# Altium schematic sheet C210_0001_Serial_Interface_220601.SchDoc: C210_0001_Serial_Interface
size B; Date: 2/26/2021; CompanyName: U-blox; DrawnBy: EMOO; Engineer: EMOO; Organization: U-blox; Address1: 2601 25th St. SE; Address2: Salem, OR 97302; SheetNumber: 1; SheetTotal: 7; Website: www.u-blox.com; SheetSize: B; SheetTitle: C-210 Serial Interface
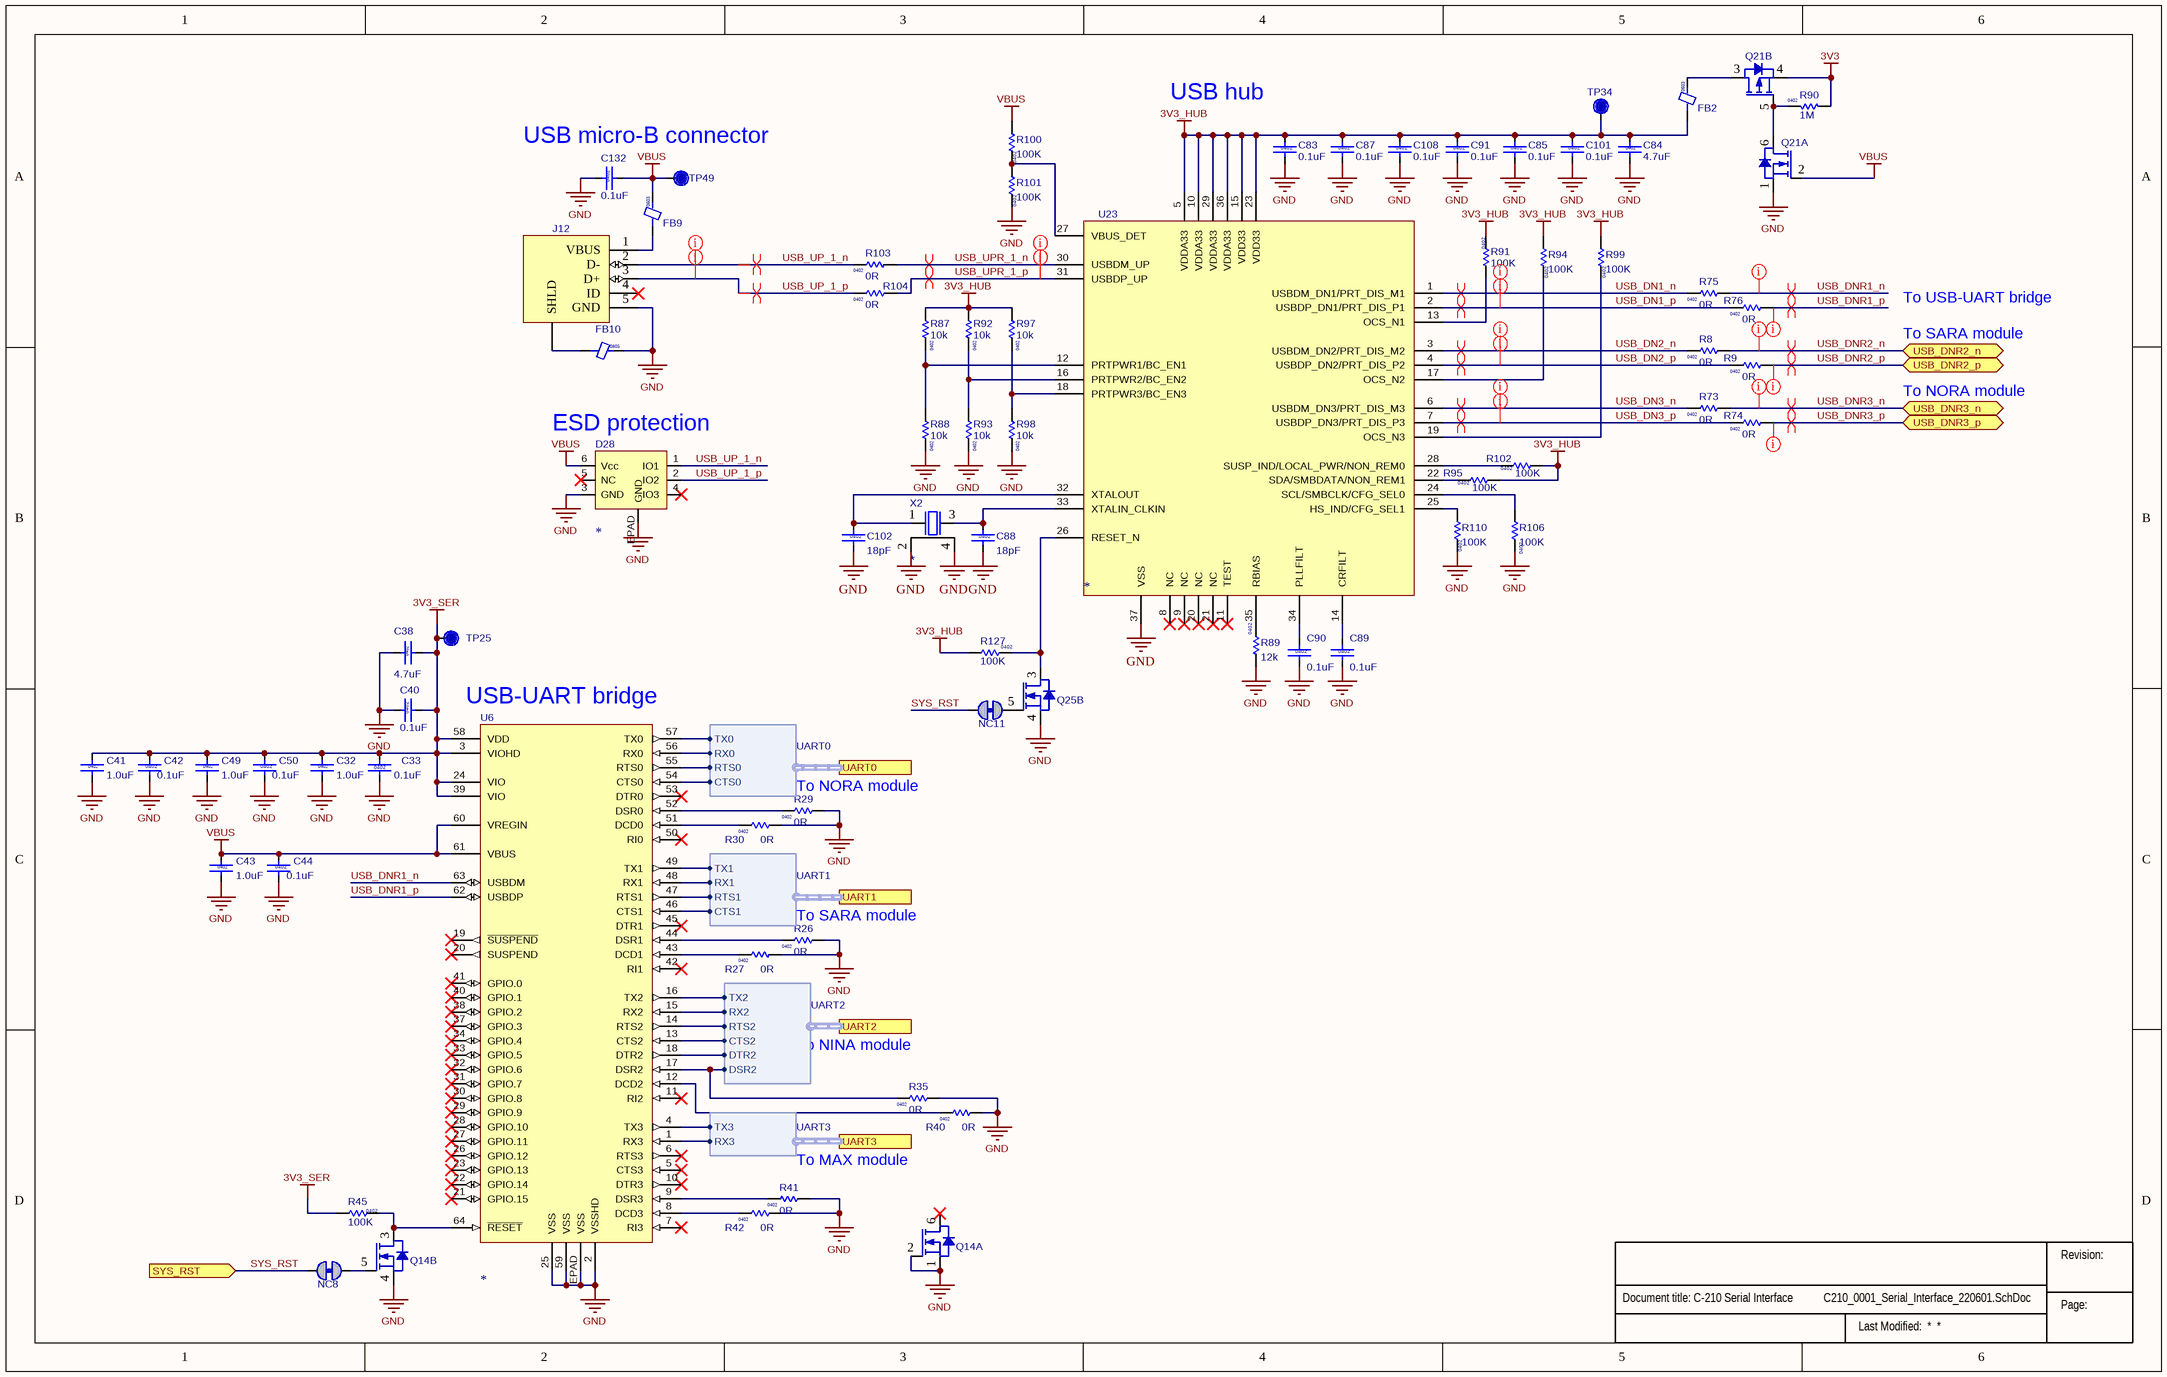
[diagram p0: C210_0001_Serial_Interface_220601.SchDoc]

## Parts
?  (no value)  (graphical)
C32  value 1.0uF  Size: 0402  [Cap 0402 HD]  (hidden comment: 120-000171.0uF)
C33  value 0.1uF  Size: 0402  [Cap 0402 HD]  (hidden comment: 120-000160.1uF)
C38  value 4.7uF  Size: 0402  [Cap 0402 HD]
C40  value 0.1uF  Size: 0402  [Cap 0402 HD]  (hidden comment: 120-000160.1uF)
C41  value 1.0uF  Size: 0402  [Cap 0402 HD]  (hidden comment: 120-000171.0uF)
C42  value 0.1uF  Size: 0402  [Cap 0402 HD]  (hidden comment: 120-000160.1uF)
C43  value 1.0uF  Size: 0402  [Cap 0402 HD]  (hidden comment: 120-000171.0uF)
C44  value 0.1uF  Size: 0402  [Cap 0402 HD]  (hidden comment: 120-000160.1uF)
C49  value 1.0uF  Size: 0402  [Cap 0402 HD]  (hidden comment: 120-000171.0uF)
C50  value 0.1uF  Size: 0402  [Cap 0402 HD]  (hidden comment: 120-000160.1uF)
C83  value 0.1uF  Size: 0402  [Cap 0402 HD]  (hidden comment: 120-000160.1uF)
C84  value 4.7uF  Size: 0402  [Cap 0402 HD]
C85  value 0.1uF  Size: 0402  [Cap 0402 HD]  (hidden comment: 120-000160.1uF)
C87  value 0.1uF  Size: 0402  [Cap 0402 HD]  (hidden comment: 120-000160.1uF)
C88  value 18pF  Size: 0402  [Cap 0402 HD]
C89  value 0.1uF  Size: 0402  [Cap 0402 HD]  (hidden comment: 120-000160.1uF)
C90  value 0.1uF  Size: 0402  [Cap 0402 HD]  (hidden comment: 120-000160.1uF)
C91  value 0.1uF  Size: 0402  [Cap 0402 HD]  (hidden comment: 120-000160.1uF)
C101  value 0.1uF  Size: 0402  [Cap 0402 HD]  (hidden comment: 120-000160.1uF)
C102  value 18pF  Size: 0402  [Cap 0402 HD]
C108  value 0.1uF  Size: 0402  [Cap 0402 HD]  (hidden comment: 120-000160.1uF)
C132  value 0.1uF  Size: 0402  [Cap 0402 HD]  (hidden comment: 120-000160.1uF)
D28  (no value)  [TPD3E001DRSR]
FB2  Size: 0603  [BLM18EG221SN1]
FB9  Size: 0603  [BLM18EG221SN1]
FB10  Size: 0805  [IND 0805]
J12  (no value)  [USB_Micro_RA_W-2TABS]
NC8  Solderbridge-ShortDNP  [Solderbridge-Short]  (value not drawn)  (net tie, no BOM)
NC11  Solderbridge-ShortDNP  [Solderbridge-Short]  (value not drawn)  (net tie, no BOM)
Q14  (no value)  [SOT-563]  (parts A,B of 2)
Q21  (no value)  [SOT-563]  (parts A,B of 2)
Q25  (no value)  [SOT-563]  (part B of 2)
R8  value 0R  Size: 0402  [RES 0402 HD]
R9  value 0R  Size: 0402  [RES 0402 HD]
R26  value 0R  Size: 0402  [RES 0402 HD]
R27  value 0R  Size: 0402  [RES 0402 HD]
R29  value 0R  Size: 0402  [RES 0402 HD]
R30  value 0R  Size: 0402  [RES 0402 HD]
R35  value 0R  Size: 0402  [RES 0402 HD]
R40  value 0R  Size: 0402  [RES 0402 HD]
R41  value 0R  Size: 0402  [RES 0402 HD]
R42  value 0R  Size: 0402  [RES 0402 HD]
R45  value 100K  Size: 0402  [RES 0402 HD]
R73  value 0R  Size: 0402  [RES 0402 HD]
R74  value 0R  Size: 0402  [RES 0402 HD]
R75  value 0R  Size: 0402  [RES 0402 HD]
R76  value 0R  Size: 0402  [RES 0402 HD]
R87  value 10k  Size: 0402  [RES 0402 HD]
R88  value 10k  Size: 0402  [RES 0402 HD]
R89  value 12k  Size: 0402  [RES 0402 HD]
R90  value 1M  Size: 0402  [RES 0402 HD]
R91  value 100K  Size: 0402  [RES 0402 HD]
R92  value 10k  Size: 0402  [RES 0402 HD]
R93  value 10k  Size: 0402  [RES 0402 HD]
R94  value 100K  Size: 0402  [RES 0402 HD]
R95  value 100K  Size: 0402  [RES 0402 HD]
R97  value 10k  Size: 0402  [RES 0402 HD]
R98  value 10k  Size: 0402  [RES 0402 HD]
R99  value 100K  Size: 0402  [RES 0402 HD]
R100  value 100K  Size: 0402  [RES 0402 HD]
R101  value 100K  Size: 0402  [RES 0402 HD]
R102  value 100K  Size: 0402  [RES 0402 HD]
R103  value 0R  Size: 0402  [RES 0402 HD]
R104  value 0R  Size: 0402  [RES 0402 HD]
R106  value 100K  Size: 0402  [RES 0402 HD]
R110  value 100K  Size: 0402  [RES 0402 HD]
R127  value 100K  Size: 0402  [RES 0402 HD]
TP25  TP  [TP12R]  (value not drawn)  (no BOM)
TP34  TP  [TP12R]  (value not drawn)  (no BOM)
TP49  TP  [TP12R]  (value not drawn)  (no BOM)
U6  (no value)  [QFN0.5P16x16-64Pin_W-Pad4.25mm]
U23  -"Part Number" + DNP  [QFN0.5P9x9-36Pin_W-PAD]  (value not drawn)
X2  (no value)  [XTAL_2520_HD]

## Ports
SYS_RST (in), UART0 (harness UART0), UART1 (harness UART1), UART2 (harness UART2), UART3 (harness UART3), USB_DNR2_n (bidir), USB_DNR2_p (bidir), USB_DNR3_n (bidir), USB_DNR3_p (bidir)

## Harnesses
UART0: TX0, RX0, RTS0, CTS0
UART1: TX1, RX1, RTS1, CTS1
UART2: TX2, RX2, RTS2, CTS2, DTR2, DSR2
UART3: TX3, RX3

## Nets
3V3: Q21.4(S2) R90.1
3V3_HUB: C83.1 C84.1 C85.1 C87.1 C91.1 C101.1 C108.1 FB2.1 R87.1 R91.2 R92.1 R94.1 R95.1 R97.1 R99.1 R102.1 R127.1 TP34.1 U23.5(VDDA33) U23.10(VDDA33) U23.15(VDD33) U23.23(VDD33) U23.29(VDDA33) U23.36(VDDA33)
3V3_SER: C32.1 C33.1 C38.2 C40.2 C41.1 C42.1 C49.1 C50.1 R45.1 TP25.1 U6.3(VIOHD) U6.24(VIO) U6.39(VIO) U6.58(VDD)
GND: C32.2 C33.2 C38.1 C40.1 C41.2 C42.2 C43.2 C44.2 C49.2 C50.2 C83.2 C84.2 C85.2 C87.2 C88.2 C89.2 C90.2 C91.2 C101.2 C102.2 C108.2 C132.1 D28.3(GND) D28.EPAD(GND) FB10.2 J12.5(GND) Q14.1(S1) Q14.2(G1) Q14.4(S2) Q21.1(S1) Q25.4(S2) R26.1 R27.1 R29.1 R30.1 R35.1 R40.1 R41.1 R42.1 R88.2 R89.1 R93.2 R98.2 R101.2 R106.2 R110.2 U6.2(VSSHD) U6.25(VSS) U6.59(VSS) U6.EPAD(VSS) U23.37(VSS) X2.2 X2.4
VBUS: C43.1 C44.1 C132.2 D28.6(Vcc) FB9.2 Q21.2(G1) R100.1 TP49.1 U6.60(VREGIN) U6.61(VBUS)
SYS_RST: NC8.2 NC11.2 ; port SYS_RST
USB_DN1_n: R75.2 U23.1(USBDM_DN1/PRT_DIS_M1)
USB_DN1_p: R76.2 U23.2(USBDP_DN1/PRT_DIS_P1)
USB_DN2_n: R8.2 U23.3(USBDM_DN2/PRT_DIS_M2)
USB_DN2_p: R9.2 U23.4(USBDP_DN2/PRT_DIS_P2)
USB_DN3_n: R73.2 U23.6(USBDM_DN3/PRT_DIS_M3)
USB_DN3_p: R74.2 U23.7(USBDP_DN3/PRT_DIS_P3)
USB_DNR1_n: R75.1 U6.63(USBDM)
USB_DNR1_p: R76.1 U6.62(USBDP)
USB_DNR2_n: R8.1 ; port USB_DNR2_n
USB_DNR2_p: R9.1 ; port USB_DNR2_p
USB_DNR3_n: R73.1 ; port USB_DNR3_n
USB_DNR3_p: R74.1 ; port USB_DNR3_p
USB_UP_1_n: D28.1(IO1) J12.2(D-) R103.2
USB_UP_1_p: D28.2(IO2) J12.3(D+) R104.2
USB_UPR_1_n: R103.1 U23.30(USBDM_UP)
USB_UPR_1_p: R104.1 U23.31(USBDP_UP)
NetC88_1: C88.1 U23.33(XTALIN_CLKIN) X2.3
NetC89_1: C89.1 U23.14(CRFILT)
NetC90_1: C90.1 U23.34(PLLFILT)
NetC102_1: C102.1 U23.32(XTALOUT) X2.1
NetFB2_2: FB2.2 Q21.3(D2)
NetFB9_1: FB9.1 J12.1(VBUS)
NetFB10_1: FB10.1 J12.6(SHLD)
NetNC8_1: NC8.1 Q14.5(G2)
NetNC11_1: NC11.1 Q25.5(G2)
NetQ14_3: Q14.3(D2) R45.2 U6.64(~{RESET})
NetQ21_5: Q21.5(G2) Q21.6(D1) R90.2
NetQ25_3: Q25.3(D2) R127.2 U23.26(RESET_N)
NetR26_2: R26.2 U6.44(DSR1)
NetR27_2: R27.2 U6.43(DCD1)
NetR29_2: R29.2 U6.52(DSR0)
NetR30_2: R30.2 U6.51(DCD0)
NetR35_2: R35.2 U6.17(DSR2) ; port UART2.DSR2
NetR40_2: R40.2 U6.12(DCD2)
NetR41_2: R41.2 U6.9(DSR3)
NetR42_2: R42.2 U6.8(DCD3)
NetR87_2: R87.2 R88.1 U23.12(PRTPWR1/BC_EN1)
NetR89_2: R89.2 U23.35(RBIAS)
NetR91_1: R91.1 U23.13(OCS_N1)
NetR92_2: R92.2 R93.1 U23.16(PRTPWR2/BC_EN2)
NetR94_2: R94.2 U23.17(OCS_N2)
NetR95_2: R95.2 U23.22(SDA/SMBDATA/NON_REM1)
NetR97_2: R97.2 R98.1 U23.18(PRTPWR3/BC_EN3)
NetR99_2: R99.2 U23.19(OCS_N3)
NetR100_2: R100.2 R101.1 U23.27(VBUS_DET)
NetR102_2: R102.2 U23.28(SUSP_IND/LOCAL_PWR/NON_REM0)
NetR106_1: R106.1 U23.24(SCL/SMBCLK/CFG_SEL0)
NetR110_1: R110.1 U23.25(HS_IND/CFG_SEL1)
NetU6_1: U6.1(RX3) ; port UART3.RX3
NetU6_4: U6.4(TX3) ; port UART3.TX3
NetU6_13: U6.13(CTS2) ; port UART2.CTS2
NetU6_14: U6.14(RTS2) ; port UART2.RTS2
NetU6_15: U6.15(RX2) ; port UART2.RX2
NetU6_16: U6.16(TX2) ; port UART2.TX2
NetU6_18: U6.18(DTR2) ; port UART2.DTR2
NetU6_46: U6.46(CTS1) ; port UART1.CTS1
NetU6_47: U6.47(RTS1) ; port UART1.RTS1
NetU6_48: U6.48(RX1) ; port UART1.RX1
NetU6_49: U6.49(TX1) ; port UART1.TX1
NetU6_54: U6.54(CTS0) ; port UART0.CTS0
NetU6_55: U6.55(RTS0) ; port UART0.RTS0
NetU6_56: U6.56(RX0) ; port UART0.RX0
NetU6_57: U6.57(TX0) ; port UART0.TX0

Not connected (* = marked no-connect by the designer): D28 4(IO3)* 5(NC)*; J12 4(ID)*; Q14 6(D1)*; U6 5(CTS3)* 6(RTS3)* 7(RI3)* 10(DTR3)* 11(RI2)* 19(~{SUSPEND})* 20(SUSPEND)* 21(GPIO.15)* 22(GPIO.14)* 23(GPIO.13)* 26(GPIO.12)* 27(GPIO.11)* 28(GPIO.10)* 29(GPIO.9)* 30(GPIO.8)* 31(GPIO.7)* 32(GPIO.6)* 33(GPIO.5)* 34(GPIO.4)* 37(GPIO.3)* 38(GPIO.2)* 40(GPIO.1)* 41(GPIO.0)* 42(RI1)* 45(DTR1)* 50(RI0)* 53(DTR0)*; U23 8(NC)* 9(NC)* 11(TEST)* 20(NC)* 21(NC)*

## Layout directives
differential pair; net class USB_DIFF: USB_DN1_n, USB_DN1_p, USB_DN2_n, USB_DN2_p, USB_DN3_n, USB_DN3_p, USB_DNR1_n, USB_DNR1_p, USB_DNR2_n, USB_DNR2_p, USB_DNR3_n, USB_DNR3_p, USB_UP_1_n, USB_UP_1_p, USB_UPR_1_n, USB_UPR_1_p
net class USB: USB_DN1_n, USB_DN1_p, USB_DN2_n, USB_DN2_p, USB_DN3_n, USB_DN3_p, USB_DNR1_n, USB_DNR1_p, USB_DNR2_n, USB_DNR2_p, USB_DNR3_n, USB_DNR3_p, USB_UP_1_n, USB_UP_1_p, USB_UPR_1_n, USB_UPR_1_p

## Notes on the sheet
- (near C83) USB hub
- USB micro-B connector
- To USB-UART bridge
- To NORA module
- To SARA module
- (near D28) ESD protection
- (near U6) USB-UART bridge
- (near R29) To NORA module
- (near R26) To SARA module
- (near R35) To NINA module
- (near R41) To MAX module
- Revision:
- Page:

## Library data of the parts
? = Sub_Title_Block: Minimized schematic title block for all subset sheets
C32 C41 C43 C49 = 120-00017: Cap, Ceramic, 1.0uF 10V 10% X5R, 0402; Part Name: CAP CER 1UF 10V 10% X5R 0402; Part_Type: Ceramic Capacitor; Manufacturer: Murata Electronics North America; Manufacturer P/N: GRM155R61A105KE15D; Item_Phase: Production; Component Mounting Type: SMT; Tolerance: +/- 10%; Use in new designs: Yes; Part Number: 120-00017; Revision: 0A; Supplier 1: Digi-Key; Supplier Part Number 1: 490-3890-1-ND; Manufacturer 2: TDK Corporation; Manufacturer P/N 2: C1005X5R1A105K050BB; Supplier 2: Digi-Key; Supplier Part Number 2: 445-4114-1-ND; Arena Link: https://app.bom.com/a/1J2AGN6N6PO5C7V9?v=spec.summary; Height: 0.55mm; Pins: 2; Temperature Coefficient: X5R; Voltage: 10V
C33 C40 C42 C44 C50 C83 C85 C87 C89-C91 C101 C108 C132 = 120-00016: Cap, Ceramic 0.1uF 10V 10% X5R 0402; Part Name: CAP CER 0.1UF 10V 10% X5R 0402; Part_Type: Ceramic Capacitor; Manufacturer: Murata Electronics North America; Manufacturer P/N: GRM155R61A104KA01J; Item_Phase: Production; Component Mounting Type: SMT; Tolerance: +/- 10%; Use in new designs: Yes; Part Number: 120-00016; Revision: 0A; Supplier 1: Digi-Key; Supplier Part Number 1: 490-6297-1-ND; Manufacturer 2: Yageo; Manufacturer P/N 2: CC0402KRX5R6BB104; Supplier 2: Digi-Key; Supplier Part Number 2: 311-1336-1-ND; Arena Link: https://app.bom.com/a/GYHPV2L2L43KRMBK?v=spec.summary; Height: 0.55mm; Pins: 2; Temperature Coefficient: X5R; Voltage: 10V
C38 C84 = 120-00020: Cap, Ceramic 4.7uF 10V 20% X5R 0402; Manufacturer 1: Samsung Electro-Mechanics America, Inc; Manufacturer Part Number 1: CL05A475MP5NRNC; Part Name: CAP CER 4.7uF 10V 20% X5R 0402; Item Phase: In Production; Tolerance: +/- 20%; Use in new designs: Yes; UBX Code: None; Part Number: 120-00020; Supplier 1: Digi-Key; Supplier Part Number 1: 1276-1482-1-ND; Manufacturer 2: Yageo; Manufacturer Part Number 2: CC0402KRX5R6BB475; Supplier 2: Digi-Key; Supplier Part Number 2: 311-3477-1-ND; Height: 0.55mm; Max Operating Temp: 85; Min Operating Temp: -55; Pins: 2; Revision: 0C; Temperature Coefficient: X5R; Voltage: 10V
C88 C102 = 120-00041: Cap, Ceramic 18pF 50V 5% NP0 0402; Manufacturer 1: NIC Components Inc; Manufacturer Part Number 1: NMC0402NPO180J50TRPF; Part Name: CAP CER 18PF 50V 5% NP0 0402; Item Phase: In Production; Tolerance: +/- 5%; Use in new designs: Yes; UBX Code: None; Part Number: 120-00041; Supplier 1: Arrow; Supplier Part Number 1: NMC0402NPO180J50TRPF; Manufacturer 2: CCK; Manufacturer Part Number 2: CCK0402NPO5J180PL; Supplier 2: None; Supplier Part Number 2: None; Height: 0.55mm; Max Operating Temp: 125; Min Operating Temp: -55; Pins: 2; Revision: 0C; Temperature Coefficient: NP0; Voltage: 50V
D28 = TPD3E001: TVS Diode, ESD High Speed 3-Channel Array, WSON-6, 3mmX3mm; Manufacturer 1: Texas Instruments; Part Name: Diode TVS 5V 3CH WSON-6; Current: None; Item Phase: In Production; MFG Package: WSON-6, DRS (S-PWSON-N6); Use in new designs: Yes; Voltage: 5.5V; Manufacturer Part Number 1: TPD3E001DRSR; Manufacturer 2: None; Manufacturer Part Number 2: None; Supplier 2: None; Supplier Part Number 2: None; Body Size: 3mm x 3mm; Height: 0.80mm; Max Operating Temp: 85; Min Operating Temp: -40; Pins: 6; Revision: 0A; UBX Code: None; Manufacturer P/N: *
FB2 FB9 = BLM18EG221SN1: Ferrite Bead, 220ohm @ 100MHz, 2A, 0603; Manufacturer 1: Murata Electronics North America; Manufacturer Part Number 1: BLM18EG221SN1D; Part Name: Ferrite Bead 220ohm 2A 0503; Body Size: None; Item Phase: Unreleased; Use in new designs: Yes; Value: None; Part Number: BLM18EG221SN1; Supplier 1: Digi-Key; Supplier Part Number 1: 490-3992-2-ND; Current: 2A; Height: 0.8mm; MFG Package: None; Max Operating Temp: 85; Min Operating Temp: -55; Pins: None; Revision: None; Voltage: None; Manufacturer 2: None; Manufacturer Part Number 2: None; Supplier 2: None; Supplier Part Number 2: None; UBX Code: None
FB10 = 155-00014: Ferrite Bead, 120ohm @ 100MHz, 3A, 0805; Manufacturer 1: Murata Electronics North America; Manufacturer Part Number 1: BLM21PG121SN1D; Part Name: Ferrite Bead 120ohm 3A 0805; Body Size: None; Item Phase: Unreleased; Use in new designs: Yes; Value: None; Part Number: 155-00014; Supplier 1: Digi-Key; Supplier Part Number 1: 490-5986-1-ND; Current: 3A; Height: 1.05mm; MFG Package: None; Max Operating Temp: 125; Min Operating Temp: -55; Pins: None; Revision: None; Voltage: None; Manufacturer 2: None; Manufacturer Part Number 2: None; Supplier 2: None; Supplier Part Number 2: None; UBX Code: None
J12 = 130-00008: USB Micro B Receptacle, Right Angle SMT with 2 TH Tabs, 0.65mm; Part Name: CON USB Micro-B SMT RA 2 Tabs; Part_Type: Connector; Manufacturer: FCI; Manufacturer P/N: 10118193-0001LF; Item_Phase: Production; Keyed: Yes; Locking: No; Rows: 1; Part Number: 130-00008; Revision: 0B; Supplier 1: Digi-Key; Supplier Part Number 1: 609-4616-1-ND; Manufacturer 2: Seeed Technology; Manufacturer P/N 2: Rigado 130-00008; Supplier 2: Seeed Technology; Supplier Part Number 2: Rigado 130-00008; Arena Link: https://app.bom.com/a/O6PX3ATATCBTBM9U?v=spec.summary; Color: Silver; Component Mounting Type: SMT; Connector Type: USB; Height: 3.10mm; Length: 5.05mm; Pin Pitch: 0.65mm; Pins: 5; Use in new designs: Yes; Width: 7.86mm
NC8 NC11 = Solderbridge-Short: Added By: Paul B; Part Number: Solderbridge-Short; Height: 0; DNP: DNP; Added Date: 12/2/2015
Q14 Q25 = 140-00016: MOSFET 2N-CH 20V 0.8A, SOT-563; Manufacturer 1: Toshiba Semiconductor and Storage; Manufacturer Part Number 1: SSM6N56FE,LM; Part Name: MOSFET 2N-CH 20V 0.8A SOT-563; Body Size: 1.6mm x 1.2mm; Current: 800mA; Item Phase: In Production; Transistor Type: N-Channel; Thermal Pad: No; Use in new designs: Yes; UBX Code: None; Part Number: 140-00016; Supplier 1: Digi-Key; Supplier Part Number 1: SSM6N56FELMCT-ND; Height: 0.6mm; MFG Package: SOT-563; Max Operating Temp: 150; Min Operating Temp: -55; Pins: 6; Revision: 0A; Voltage: 20V; Manufacturer 2: None; Manufacturer Part Number 2: None; Supplier 2: None; Supplier Part Number 2: None
Q21 = 140-00030: MOSFET N/P-CH 20V SOT-563, 540 mA, −430 mA; Manufacturer 1: ON Semiconductor; Manufacturer Part Number 1: NTZD3155CT2G; Body Size: 1.6mmx1.6mm; Item Phase: In Production; Transistor Type: Multiple; Thermal Pad: No; Use in new designs: Yes; UBX Code: None; Part Number: 140-00030; Supplier 1: Digi-Key; Supplier Part Number 1: NTZD3155CT2GOSCT-ND; Current: 540 mA, −430 mA; Height: 0.6mm; MFG Package: SOT-563; Max Operating Temp: 150; Min Operating Temp: -55; Part Name: MOSFET N/P-CH 20V SOT-563; Pins: 6; Revision: 0A; Voltage: 20V; Manufacturer 2: None; Manufacturer Part Number 2: None; Supplier 2: None; Supplier Part Number 2: None
R8 R9 R26 R27 R29 R30 R35 R40-R42 R73-R76 R103 R104 = 180-00020: Resistor 0 ohm 1/16W 0402; Manufacturer 1: Yageo; Manufacturer Part Number 1: RC0402FR-070RL; Part Name: RES SMD 0.0 OHM JUMPER 1/16W 0402; Item Phase: In Production; Tolerance: None; Use in new designs: Yes; Part Number: 180-00020; Supplier 1: Digi-Key; Supplier Part Number 1: 311-0.0LRCT-ND; Manufacturer 2: Hong Kong Resistors Manufactory; Manufacturer Part Number 2: RCT020RLF; Supplier 2: None; Supplier Part Number 2: None; Height: 0.40mm; Max Operating Temp: 155; Min Operating Temp: -55; Pins: 2; Power: 1/16W; Revision: 0E; Voltage: N/A; UBX Code: None
R45 R91 R94 R95 R99-R102 R106 R110 R127 = 180-00093: Resistor 100K ohm 1% 1/16W, 0402; Manufacturer 1: Yageo; Manufacturer Part Number 1: RC0402FR-07100KL; Part Name: RES SMD 100K ohm 1% 1/16W 0402; Item Phase: In Production; Tolerance: +/- 1%; Use in new designs: Yes; Voltage: None; Part Number: 180-00093; Supplier 1: Digi-Key; Supplier Part Number 1: 311-100KLRCT-ND; Manufacturer 2: Rohm Semiconductor; Manufacturer Part Number 2: MCR01MRTF1003; Supplier 2: Digi-Key; Supplier Part Number 2: RHM100KCDCT-ND; Height: 0.4mm; Max Operating Temp: 155; Min Operating Temp: -55; Pins: 2; Power: 1/16W; Revision: 0B; UBX Code: None
R87 R88 R92 R93 R97 R98 = 180-00024: Resistor 10k ohm 1% 1/16W, 0402; Manufacturer 1: Samsung Electro-Mechanics America, Inc; Manufacturer Part Number 1: RC1005F103CS; Part Name: RES SMD 10K OHM 1% 1/16W 0402; Item Phase: In Production; Tolerance: +/- 1%; Use in new designs: Yes; UBX Code: None; Part Number: 180-00024; Supplier 1: Digi-Key; Supplier Part Number 1: 1276-3431-1-ND; Manufacturer 2: Hong Kong Resistors Manufactory; Manufacturer Part Number 2: RCT0210KFLF; Supplier 2: None; Supplier Part Number 2: None; Height: 0.4mm; Max Operating Temp: 155; Min Operating Temp: -55; Pins: 2; Power: 1/16W; Revision: 0E; Voltage: N/A
R89 = 180-00096: Resistor 12k ohm 1% 1/16W 0402; Manufacturer 1: None; Part Name: RES SMD 12K OHM 1% 1/16W 0402; Item Phase: In Production; Tolerance: +/- 1%; Use in new designs: Yes; Part Number: 180-00096; Manufacturer Part Number 1: None; Supplier 1: Digi-Key; Supplier Part Number 1: 1276-4122-1-ND; Manufacturer 2: Yageo; Manufacturer Part Number 2: RC0402FR-0712KL; Supplier 2: Digi-Key; Supplier Part Number 2: 311-12.0KLRCT-ND; Height: 0.4mm; Max Operating Temp: 155; Min Operating Temp: -55; Pins: 2; Power: 1/16W; Revision: 0A; Voltage: None; UBX Code: None
R90 = 180-00054: Resistor 1M ohm 1%, 1/16W, 0402; Manufacturer 1: Samsung Electro-Mechanics America, Inc; Manufacturer Part Number 1: RC1005F105CS; Part Name: RES SMD 1M OHM 1% 1/16W 0402; Item Phase: In Production; Tolerance: +/- 1%; Use in new designs: Yes; Voltage: None; Part Number: 180-00054; Supplier 1: Digi-Key; Supplier Part Number 1: 1276-3433-1-ND; Manufacturer 2: Hong Kong Resistors Manufactory; Manufacturer Part Number 2: RCT021MFLF; Supplier 2: None; Supplier Part Number 2: None; Height: 0.4mm; Max Operating Temp: 155; Min Operating Temp: -55; Pins: 2; Power: 1/16W; Revision: 0D; UBX Code: None
TP25 TP34 TP49 = TP_R: Testpoint, Round 1.0mm Dia; Part Number: TP10R; Added By: Jeremy D; Size: 1.0mm; Height: 0; DNP: DNP; Added Date: 2/1/2015; Checked By: Paul B; Checked Date: 2/5/2015
U6 = 220-00051: IC BRIDGE USB TO UART 64QFN; Manufacturer 1: Silicon Labs; Manufacturer Part Number 1: CP2108-B03-GMR; Part Name: IC USB FS QUAD UART/GPIO, 64-QFN; Body Size: 9mm x9mm; Item Phase: Pre-Production; MFG Package: 64 Pin QFN; SMT Pitch: 0.50mm; Thermal Pad: Yes; Voltage: 3.6V; UBX Code: None; Manufacturer P/N: *; Part Number: 220-00051; Supplier 1: Digi-Key; Supplier Part Number 1: 336-5105-1-ND; Height: 0.9mm; Interface: USB; Max Operating Temp: 85; Min Operating Temp: -40; Pins: 64; Revision: 1; Use in new designs: Yes
U23 = 220-00017: 3-PORT USB 2.0 HUB CTRLR, QFN-36; Manufacturer 1: Microchip Technology; Manufacturer Part Number 1: USB2513B-AEZC-TR; Part Name: USB2513B-AEZC; Body Size: 6mm x 6mm; Interface: I2C; Item Phase: Unreleased; SMT Pitch: 0.5mm; Thermal Pad: Yes; Voltage: 3.6V; UBX Code: None; Manufacturer P/N: *; Part Number: 220-00017; Supplier 1: Digi-Key; Supplier Part Number 1: USB2513B-AEZC-CT-ND; Height: 1mm; MFG Package: QFN-36; Max Operating Temp: 85; Min Operating Temp: 0; Pins: 36; Revision: None; Use in new designs: Yes
X2 = 100-00017: Crystal, 24.0000MHz, 20ppm, 10pF, 100 Ohm, -20Â°C - 70Â°C, SMT 4 Pin 2520; Manufacturer 1: Abracon LLC; Manufacturer Part Number 1: ABM10-24.000MHZ-E20-T; Part Name: XTAL 24MHz 10pF 20ppm 2520; Body Size: 2.5mm x 2.0mm; Item Phase: Unreleased; MFG Package: 2520; Use in new designs: Yes; Voltage: None; Value: *; Part Number: 100-00017; Supplier 1: Digi-Key; Supplier Part Number 1: 535-9093-1-ND; Manufacturer 2: None; Manufacturer Part Number 2: None; Supplier 2: None; Supplier Part Number 2: None; Height: 0.7mm; Max Operating Temp: 70; Min Operating Temp: -20; Pins: 4; Revision: None; UBX Code: None